# EAGLE design step (EAGLE 9.3.2)
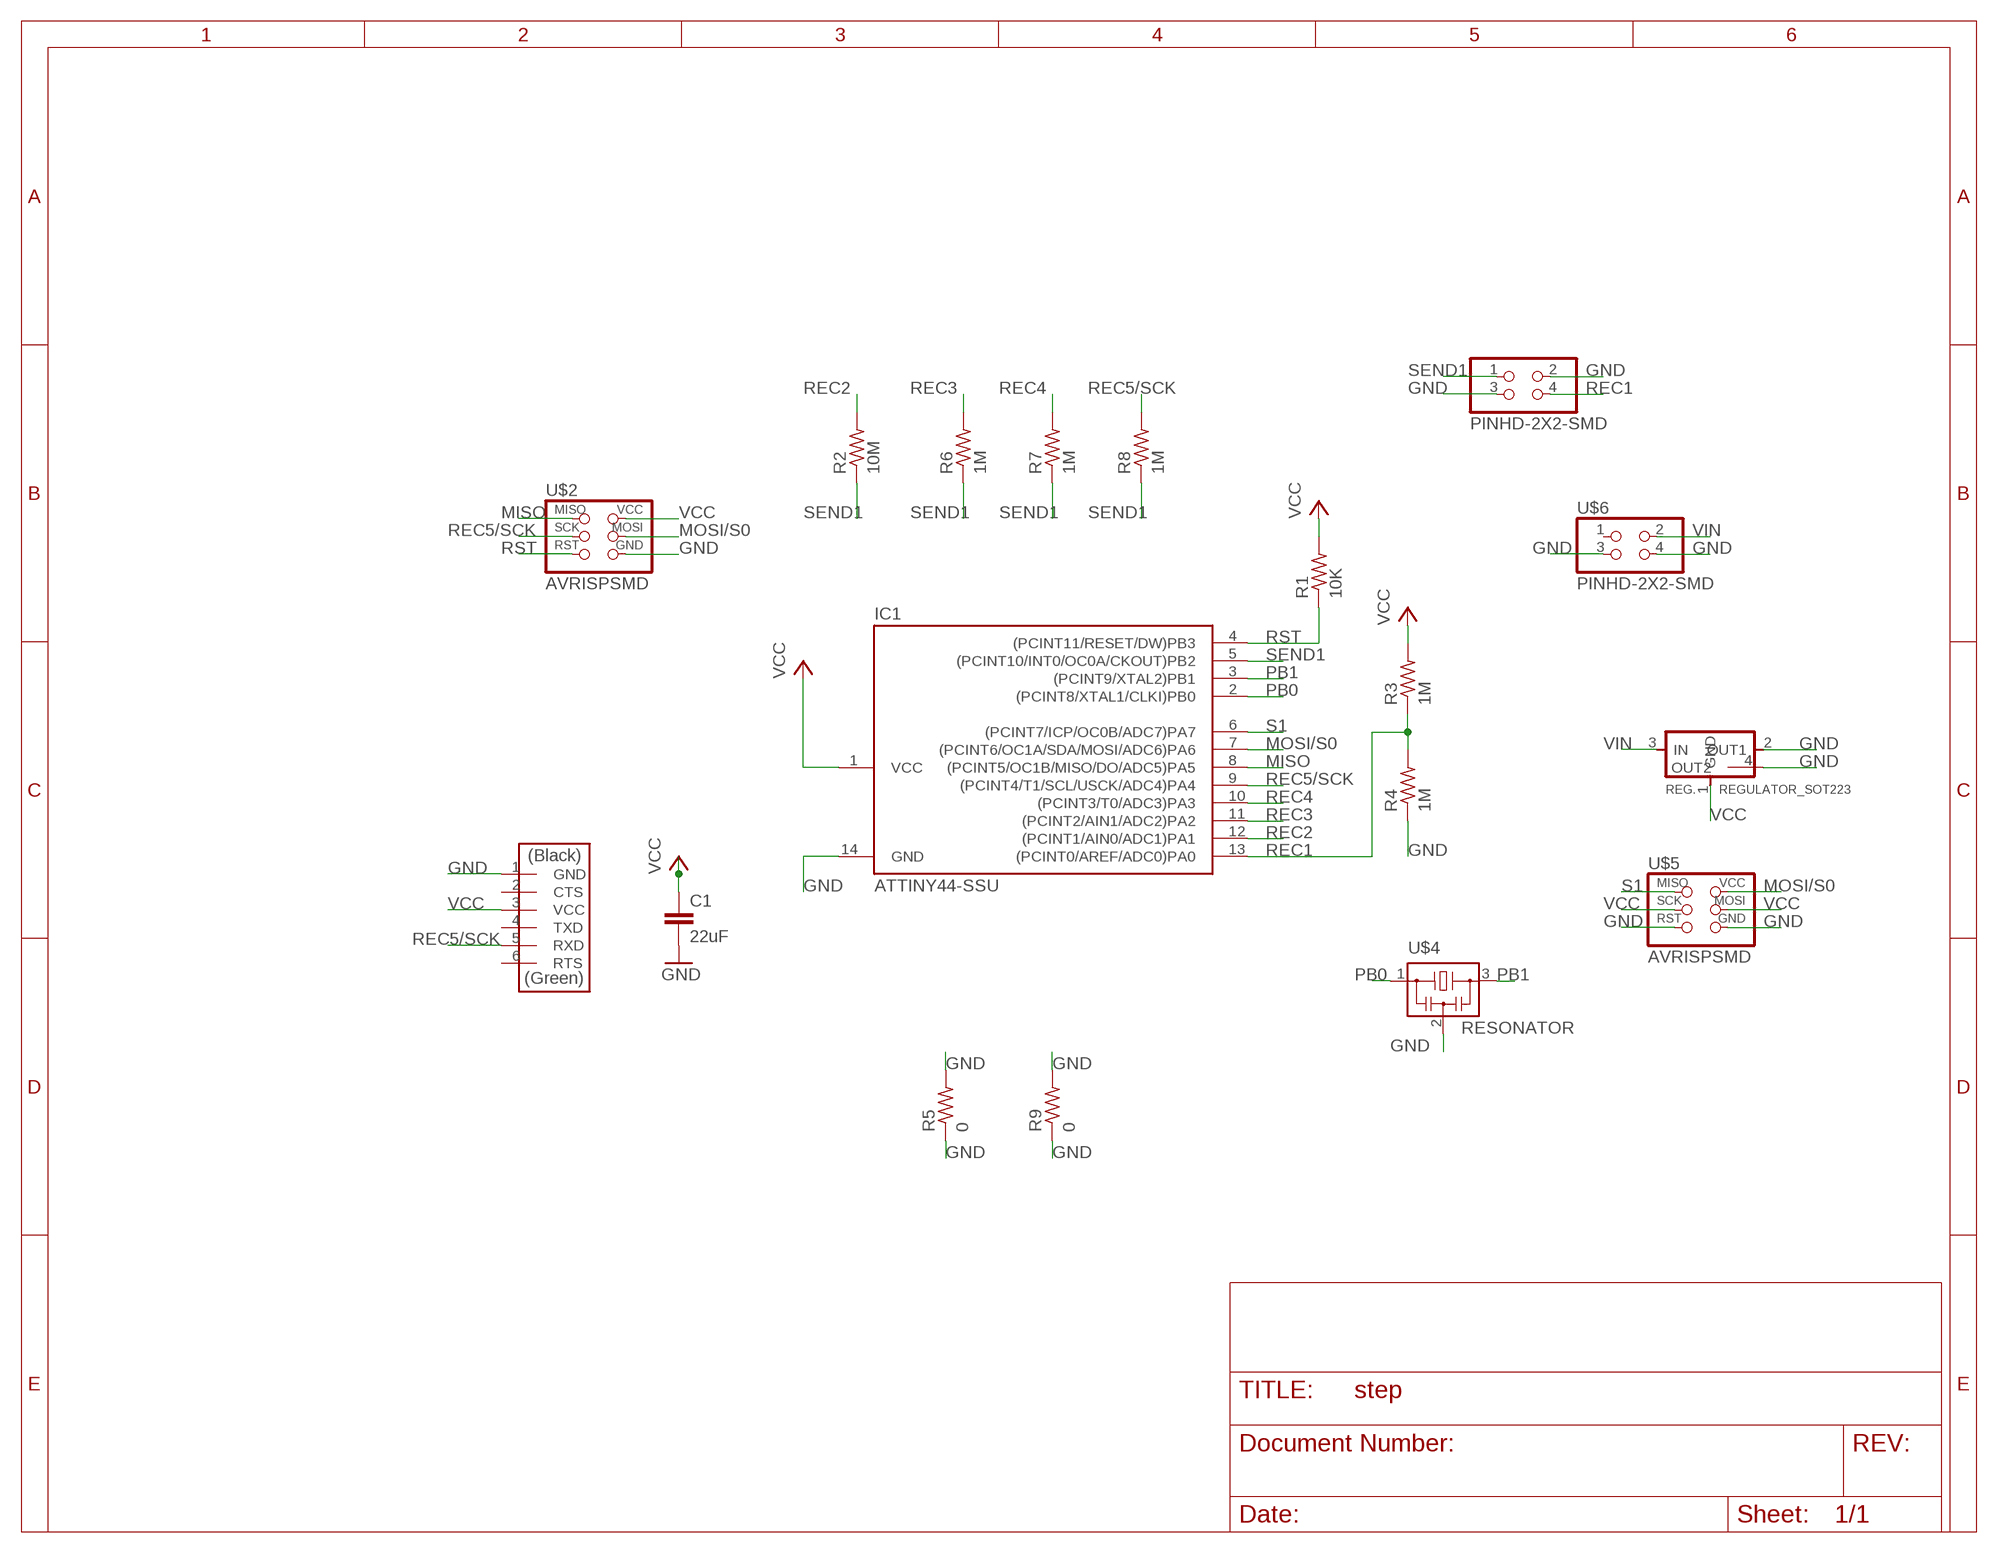
[diagram p0: schematic, sheet 1]

## Parts
C1  22uF  C-EUC1206  [C1206]
IC1  ATTINY44-SSU  [SOIC14]
R1  10K  RES-US1206FAB  [R1206FAB]
R2  10M  RES-US1206FAB  [R1206FAB]
R3  1M  RES-US1206FAB  [R1206FAB]
R4  1M  RES-US1206FAB  [R1206FAB]
R5  0  RES-US1206FAB  [R1206FAB]
R6  1M  RES-US1206FAB  [R1206FAB]
R7  1M  RES-US1206FAB  [R1206FAB]
R8  1M  RES-US1206FAB  [R1206FAB]
R9  0  RES-US1206FAB  [R1206FAB]
REG.  REGULATOR_SOT223  [SOT223]
STEP/GND-SMD  PINHD-2X2-SMD  [2X02SMD]
U$1  FTDI-SMD-HEADER  [1X06SMD]
U$2  AVRISPSMD  [2X03SMD]
U$4  RESONATOR  [EFOBM]
U$5  AVRISPSMD  [2X03SMD]
U$6  PINHD-2X2-SMD  [2X02SMD]

## Nets
GND: C1.2 IC1.14(GND) R4.1 R5.1 R5.2 R9.1 R9.2 REG..2(OUT1) REG..4(OUT2) STEP/GND-SMD.2 STEP/GND-SMD.3 U$1.1(GND) U$2.6(GND) U$4.2 U$5.5(RST) U$5.6(GND) U$6.3 U$6.4
MISO: IC1.8((PCINT5/OC1B/MISO/DO/ADC5)PA5) U$2.1(MISO)
MOSI/S0: IC1.7((PCINT6/OC1A/SDA/MOSI/ADC6)PA6) U$2.4(MOSI) U$5.2(VCC)
PB0: IC1.2((PCINT8/XTAL1/CLKI)PB0) U$4.1
PB1: IC1.3((PCINT9/XTAL2)PB1) U$4.3
REC1: IC1.13((PCINT0/AREF/ADC0)PA0) R3.1 R4.2 STEP/GND-SMD.4
REC2: IC1.12((PCINT1/AIN0/ADC1)PA1) R2.2
REC3: IC1.11((PCINT2/AIN1/ADC2)PA2) R6.2
REC4: IC1.10((PCINT3/T0/ADC3)PA3) R7.2
REC5/SCK: IC1.9((PCINT4/T1/SCL/USCK/ADC4)PA4) R8.2 U$1.5(RXD) U$2.3(SCK)
RST: IC1.4((PCINT11/RESET/DW)PB3) R1.1 U$2.5(RST)
S1: IC1.6((PCINT7/ICP/OC0B/ADC7)PA7) U$5.1(MISO)
SEND1: IC1.5((PCINT10/INT0/OC0A/CKOUT)PB2) R2.1 R6.1 R7.1 R8.1 STEP/GND-SMD.1
VCC: C1.1 IC1.1(VCC) R1.2 R3.2 REG..1(GND) U$1.3(VCC) U$2.2(VCC) U$5.3(SCK) U$5.4(MOSI)
VIN: REG..3(IN) U$6.2
Unconnected: U$1.2(CTS) U$1.4(TXD) U$1.6(RTS) U$6.1

## Library data of the parts
C1 = rcl:C-EU: CAPACITOR, European symbol
IC1 = fab:ATTINY44
R1-R9 = 00fab:RES-US: Resistor (US Symbol) Variants with postfix FAB are widened to allow the routing of internal traces
REG. = fab:REGULATOR_SOT223
STEP/GND-SMD U$6 = fab:PINHD-2X2-SMD
U$1 = fab:FTDI-SMD-HEADER
U$2 U$5 = fab:AVRISP
U$4 = fab:RESONATOR

## Board
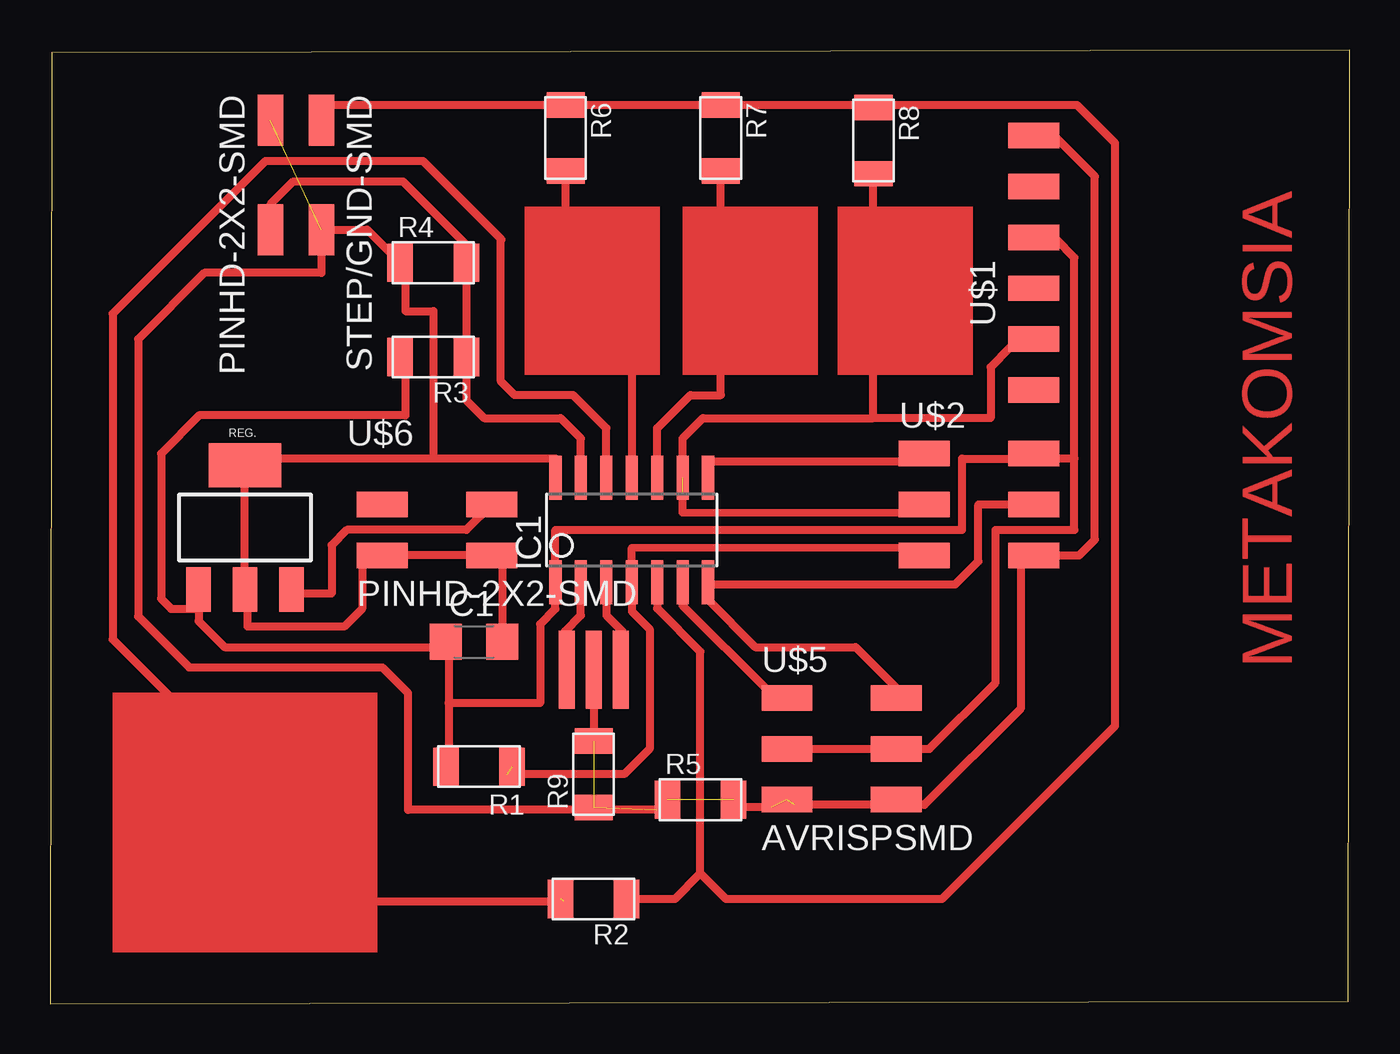
[diagram p1: board, top side]

Size 64.88 x 47.6 mm. Coordinates in mm from the lower left corner, seen from the top.
Outline: 0,0 64.8,0.13 64.88,47.6 0.08,47.47 0,0
Copper layers (1*16): Top 0.035mm / dielectric 1.5mm / Bottom 0.035mm
Design rules "default *": minimum track width 6mil, minimum drill 0.35mm, track to track 16mil, track to pad 16mil, pad to pad 16mil, via to via 6mil, smd to smd 16mil, copper to edge 40mil, drill to drill 6mil, minimum pad ring 10mil, minimum via ring 8mil, stop-mask expansion 4mil, vias tented up to drill 0mil, thermal gap 10mil

### Footprints (pad centres in the part's own frame; a part is rotated, then mirrored left to right if it is on the bottom)
C1206 = smd 1.6 x 1.8: 1 -1.4,0; 2 1.4,0
SOIC14 = smd 0.61 x 2.21: 1 -3.81,-2.603; 2 -2.54,-2.603; 3 -1.27,-2.603; 4 0,-2.603; 5 1.27,-2.603; 6 2.54,-2.603; 7 3.81,-2.603; 8 3.81,2.603; 9 2.54,2.603; 10 1.27,2.603; 11 0,2.603; 12 -1.27,2.603; 13 -2.54,2.603; 14 -3.81,2.603
R1206FAB = smd 1.27 x 1.905: 1 -1.651,0; 2 1.651,0
SOT223 = smd 1.219 x 2.235: 1 -2.311,-3.099; 2 0,-3.099; 3 2.311,-3.099 | smd 3.6 x 2.2: 4 0,3.099
2X02SMD = smd 2.54 x 1.27: 1 -2.54,1.27; 2 2.92,1.27; 3 -2.54,-1.27; 4 2.92,-1.27
1X06SMD = smd 2.54 x 1.27: 1 0,6.35; 2 0,3.81; 3 0,1.27; 4 0,-1.27; 5 0,-3.81; 6 0,-6.35
2X03SMD = smd 2.54 x 1.27: 1 -2.54,2.54; 2 2.92,2.54; 3 -2.54,0; 4 2.92,0; 5 -2.54,-2.54; 6 2.92,-2.54
EFOBM = smd 0.8 x 3.9: 1 -1.35,0; 2 0,0; 3 1.35,0

### Placement (x,y rotation side)
C1  21.16,18.06 0 top
IC1  29.03,23.65 0 top
R1  21.41,11.84 180 top
R2  27.13,5.23 180 top
R3  19.13,32.28 180 top
R4  19.13,36.98 0 top
R5  32.46,10.19 0 top
R6  25.73,43.21 270 top
R7  33.48,43.21 270 top
R8  41.1,43.08 270 top
R9  27.13,11.46 90 top
REG.  9.73,23.77 0 top
STEP/GND-SMD  12.27,41.55 270 top
U$1  49.1,36.98 0 top
U$2  46.18,24.92 0 top
U$4  27.13,16.66 0 top
U$5  39.32,12.73 0 top
U$6  19.13,23.65 0 top

### Tracks (layer width: path | path; a pad name or v marks a point on that pad's centre or on a via)
GND  (6 unrouted)
  Top 0.152: 25.22,27.2 25.25,27.13 25.25,26.37 IC1.14 25.25,26.21 25.25,25.76 | 9.86,27.2 9.86,26.97 REG..4 | 9.98,19.84 9.86,19.96 9.86,20.57 REG..2 | 15.57,21.87 16.1,22.4 16.41,22.4 U$6.3 | U$1.1 49.17,43.28 49.94,43.28 50.11,43.33 | 48.46,22.4 49.02,22.4 U$2.6 | 27.08,15.24 27.08,16.61 U$4.2 | STEP/GND-SMD.2 13.21,38.1 13.51,37.8 13.54,37.62 | 17.73,36.35 17.63,36.42 17.63,36.88 R4.1
  Top 0.406: 37.16,9.93 41.99,9.93 U$5.6 42.49,9.93 43.64,9.93 48.46,14.76 48.46,22.4 48.46,22.63 | 37.29,10.49 36.98,10.19 U$5.5 | 50.11,43.33 52.15,41.3 52.15,23.16 51.36,22.38 U$2.6 | STEP/GND-SMD.2 15.82,38.63 R4.1 | U$6.3 U$6.4 22.56,21.87 C1.2 | 15.57,21.87 15.57,19.71 14.68,18.82 9.86,18.82 9.86,19.71 9.98,19.84 | REG..2 REG..4 | 25.22,27.2 19.13,27.2 | 19.13,27.2 9.86,27.2 9.83,27.2 | STEP/GND-SMD.2 13.16,38.25 | 13.54,37.62 13.67,37.62 | 17.73,36.35 17.73,34.57 19.13,34.57 19.13,27.2 | R5.1 30.3,9.68 17.86,9.68 17.86,15.52 16.59,16.79 6.93,16.79 4.39,19.33 4.39,33.17 7.7,36.47 13.54,36.47 STEP/GND-SMD.2 | 36.02,9.8 34.49,9.8 R5.2 | U$4.2 R9.2
MISO
  Top 0.152: U$2.1 43.54,27.43 42.77,27.43 42.47,27.13 42.37,27.08
  Top 0.406: IC1.8 32.84,27.08 42.37,27.08
MOSI/S0
  Top 0.152: 42.37,15.65 42.37,15.37 U$5.2 | 48.21,24.92 48.26,24.99 49.02,24.99 U$2.4
  Top 0.406: 48.21,24.92 46.33,24.92 46.33,22.09 45.16,20.92 32.97,20.92 IC1.7 32.84,20.15 35.19,17.81 40.21,17.81 42.37,15.65
PB0
  Top 0.152: 26.49,21.03 26.47,21.03 IC1.2 | 25.71,18.59 25.71,16.76 U$4.1
  Top 0.406: 25.71,18.59 26.49,19.38 26.49,21.03 IC1.2
PB1
  Top 0.152: 28.6,18.54 28.6,16.76 U$4.3
  Top 0.406: IC1.3 27.76,19.38 28.6,18.54
REC1
  Top 0.152: IC1.13 26.47,26.37 26.47,26.67 26.42,26.75 | R4.2 20.83,37.03 20.83,37.64 20.78,37.74
  Top 0.406: R4.2 R3.1 20.78,30.12 21.67,29.24 25.48,29.24 26.49,28.22 26.49,26.82 26.42,26.75 | 20.78,37.74 20.78,37.87 17.6,41.05 12.14,41.05 11,39.9 STEP/GND-SMD.4
REC2  (1 unrouted)
  Top 0.152: 25.93,5.92 R2.2 | 22.5,38.1 22.54,38.14
  Top 0.406: 22.54,38.14 18.62,42.06 10.74,42.06 3.12,34.44 3.12,18.19 10.62,10.69 15.06,10.69 15.06,5.11 25.65,5.11 | IC1.12 27.76,28.73 26.11,30.38 23.19,30.38 22.5,31.06 22.5,38.1
REC3
  Top 0.152: 25.86,41.61 R6.2 | 29.06,26.52 IC1.11
  Top 0.406: 29.06,26.52 29.06,38.63 | 29.06,38.63 29.06,38.87 | 29.06,38.63 26.11,38.63 25.73,39.01 R6.2
REC4
  Top 0.152: R7.2 33.48,41.45
  Top 0.406: IC1.10 30.3,28.73 31.95,30.38 33.48,30.38 33.48,41.45
REC5/SCK  (1 unrouted)
  Top 0.152: 48.08,32.79 48.26,32.77 48.72,32.77 49.02,33.07 U$1.5
  Top 0.381: 43.64,24.51 31.57,24.51
  Top 0.406: 41.1,29.24 R8.2 | 43.64,24.51 U$2.3 | IC1.9 31.57,28.22 32.59,29.24 41.1,29.24 | 41.1,29.24 46.94,29.24 46.94,31.78 47.96,32.79 48.08,32.79 | 31.57,24.51 31.57,25.43
RST  (1 unrouted)
  Top 0.152: U$2.5 43.54,22.4 43.08,22.4 42.77,22.71 42.62,22.76
  Top 0.381: 29.03,22.76 42.62,22.76
  Top 0.406: 29.03,22.76 IC1.4 29.03,19.58 29.92,18.69 29.92,12.73 28.65,11.46 22.81,11.46
S1
  Top 0.152: U$5.1 36.25,15.8 36.02,15.8 35.83,15.61
  Top 0.406: 35.83,15.61 31.57,19.88 IC1.6
SEND1
  Top 0.152: 40.79,44.96 40.79,44.86 | 13.67,44.86 13.67,44.2 STEP/GND-SMD.1 | 40.79,44.96 R8.1 | 40.79,44.96 40.97,44.86
  Top 0.406: 13.67,44.86 R6.1 R7.1 40.79,44.86 40.97,44.86 51.26,44.86 53.16,42.95 53.16,13.87 44.53,5.23 33.73,5.23 32.46,6.5 | IC1.5 30.3,19.74 32.46,17.58 32.46,6.5 | R2.1 31.19,5.23 32.46,6.5
VCC
  Top 0.152: U$1.3 49.78,38.25 49.86,38.13 | 42.34,13.03 42.34,12.73 | 48.34,27.2 48.57,27.43 49.02,27.43 U$2.2 49.17,27.43 49.33,27.28 50.09,27.28 50.24,27.2 | IC1.1 25.25,20.88 25.25,20.27 25.22,20.22
  Top 0.406: IC1.1 25.22,23.65 45.52,23.65 45.52,27.2 48.34,27.2 | U$5.3 U$5.4 | 42.34,12.73 U$5.4 | U$5.4 43,12.73 | U$5.4 43.89,12.73 47.19,16.03 47.19,23.65 51.13,23.65 51.13,27.2 | 51.13,27.2 50.24,27.2 | 51.13,27.2 51.13,37.24 50.24,38.13 49.86,38.13 | REG..1 7.42,19.71 | 7.42,19.71 7.42,19.1 8.71,17.81 19.5,17.81 C1.1 19.89,17.93 19.89,15.01 | R3.2 17.73,32.03 17.73,29.36 7.44,29.36 5.54,27.46 5.54,20.22 6.05,19.71 7.42,19.71 | 25.22,20.22 25.22,19.71 24.46,18.95 24.46,15.01 19.89,15.01 | 19.89,15.01 19.89,11.96 R1.2
VIN
  Top 0.406: U$6.2 20.78,23.65 14.81,23.65 14.05,22.89 14.05,20.47 12.24,20.47 REG..3
(copper drawn outside any net)
  shapes: Top area x8

### Text on the board
Top: METAKOMSIA